# Altium schematic sheet power_schem.SchDoc
size B; SheetNumber: 2; SheetTotal: 3
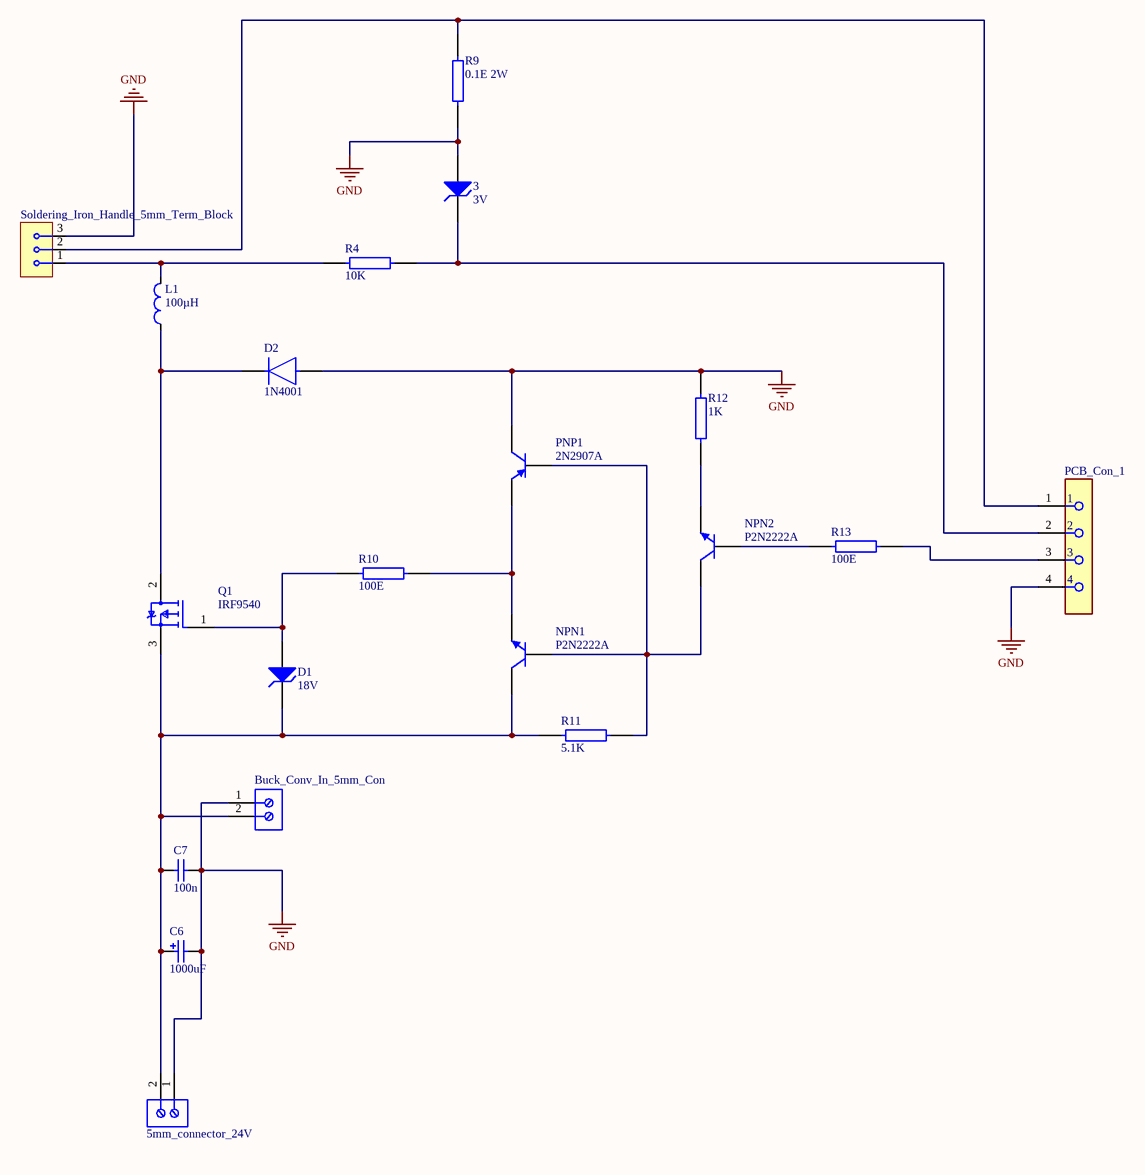
[diagram p0: power_schem.SchDoc]

## Parts
3  3V  [Zener_Diode]
5mm_connector_24V  (no value)  [screw_terminal]
Buck_Conv_In_5mm_Con  (no value)  [screw_terminal]
C6  1000uF  [Capacitor_Polarised]
C7  100n  [Capacitor_Monolitoc]
D1  18V  [Zener_Diode]
D2  1N4001  [Zener_Diode]
L1  100µH  [Coil]
NPN1  P2N2222A  [NPN_Transistor_2N2222A]
NPN2  P2N2222A  [NPN_Transistor_2N2222A]
PCB_Con_1  (no value)  [Header-Female-JST_4pin]
PNP1  2N2907A  [PNP_Transistor_2N2907A]
Q1  IRF9540  [Mosfet_IRF9540NPBF]
R4  10K  [Resistor]
R9  0.1E 2W  [Resistor]
R10  100E  [Resistor]
R11  5.1K  [Resistor]
R12  1K  [Resistor]
R13  100E  [Resistor]
Soldering_Iron_Handle_5mm_Term_Block  (no value)  [3Pin_Connector]

## Nets
GND: 3.2(A) 5mm_connector_24V.1 Buck_Conv_In_5mm_Con.1 C6.2 C7.2 D2.2(A) PCB_Con_1.4 PNP1.3(C) R9.1 R12.2 Soldering_Iron_Handle_5mm_Term_Block.3
Net3_1: 3.1(K) PCB_Con_1.2 R4.2
Net5mm_connector_24V_2: 5mm_connector_24V.2 Buck_Conv_In_5mm_Con.2 C6.1 C7.1 D1.1(K) NPN1.1(C) Q1.3(S) R11.1
NetD1_2: D1.2(A) Q1.1(G) R10.1
NetD2_1: D2.1(C) L1.1 Q1.2(D)
NetL1_2: L1.2 R4.1 Soldering_Iron_Handle_5mm_Term_Block.1
NetNPN1_2: NPN1.2(B) NPN2.1(C) PNP1.2(B) R11.2
NetNPN1_3: NPN1.3(E) PNP1.1(E) R10.2
NetNPN2_2: NPN2.2(B) R13.2
NetNPN2_3: NPN2.3(E) R12.1
NetPCB_Con_1_1: PCB_Con_1.1 R9.2 Soldering_Iron_Handle_5mm_Term_Block.2
NetPCB_Con_1_3: PCB_Con_1.3 R13.1

## Library data of the parts
3 D1 = Zener_Diode: PartNumber: 1N5931BRLG; Manufacturer: On Semiconductor; Packing: Tape and Reel; VZ Typ (V): 18; DatasheetVersion: Rev. 5; PackageVersion: Rev. U, 02/2005; ComponentLink1URL: http://www.onsemi.com/; ComponentLink3URL: http://www.onsemi.cn/pub_link/Collateral/59-10.PDF; RoHS: Pb-Free; ComponentLink3Description: Package Specification; ComponentLink1Description: Manufacturer URL; PackageReference: AXIAL_LEAD-2-59-10; PackageDescription: 2-Pin, Axial Lead, Diameter 2.35 mm; ComponentLink2URL: http://www.onsemi.cn/pub_link/Collateral/1N5913B-D.PDF; ComponentLink2Description: Datasheet; Mounting Technology: Through Hole
5mm_connector_24V Buck_Conv_In_5mm_Con = Screw_Terminal: NexarPartId: 18818288; Plating: Brass, Steel; Current: 10A; Pitch: 3.5052mm; Number of Levels: 1; Number of Contacts: 2; Wire Gauge (Min): 16AWG; Voltage: 300V; Wire Gauge (Max): 24AWG; Stripping Length: -6mm; Number of Pins: 2; Number of Rows: 1; REACH SVHC: Unknown; RoHS: Compliant; Housing Material: Nylon; Termination: Screw; Mount: Through Hole; Contact Plating: Brass, Tin; Number of Positions Per Level: 2; Color: Blue, Green; Width: 7.9mm; Voltage Rating: 300V; Length: 7.4mm; Current Rating: 10A; Wire/Cable Gauge: 24AWG; Packaging: Box; Max Operating Temperature: 105°C; Lead Pitch: 3.5mm; Height: 8.7mm; Contact Material: Brass; Min Operating Temperature: -40°C
C6 = Capacitor_Polarised: Manufacturer: Murata; Packaging type: Bulk; CS: 5mm; Tolerance: 10%; Capacity (elec.): 10nF; Material: Ceramic; Type: radiallead; Industrial packaging: Yes; Nominal voltage: 1000V; Content: 500pc(s); Category: Ceramiccapacitor; Datasheet Version: 06/2016; Package Reference: DEBF33A103ZA2B; Mounting Technology: ThroughHole; Package Description: 2-Pin Through Hole Device, Body 4 x 10 mm, Pitch 5 mm; Datasheet URL: http://psearch.en.murata.com/capacitor/product/DEBF33A103ZA2B.pdf; Manufacturer URL: http://www.murata.com/
C7 = Capacitor_Monolitic: Manufacturer: Murata; Packaging type: Bulk; CS: 5mm; Tolerance: 10%; Capacity (elec.): 10nF; Material: Ceramic; Type: radiallead; Industrial packaging: Yes; Nominal voltage: 1000V; Content: 500pc(s); Category: Ceramiccapacitor; Datasheet Version: 06/2016; Package Reference: DEBF33A103ZA2B; Mounting Technology: ThroughHole; Package Description: 2-Pin Through Hole Device, Body 4 x 10 mm, Pitch 5 mm; Datasheet URL: http://psearch.en.murata.com/capacitor/product/DEBF33A103ZA2B.pdf; Manufacturer URL: http://www.murata.com/
D2 = Diode_UF5408: Capacitance: 36pF; Average Rectified Current: 3A; Recovery Time: 75ns; Max Reverse Current: 10uA; Outside Diameter: 5.3mm; Forward Voltage: 1.7V; Peak Non-Repetitive Surge Current: 150A; Max Repetitive Reverse Voltage (Vrrm): 1kV; Element Configuration: Single; Polarity: Standard; Width: 5.3mm; Mount: Through Hole; Number of Pins: 2; Case/Package: DO-201AD; Series: -; Packaging: Tape and Reel; Max Surge Current: 150A; Length: 9.5mm; Lead Free: Lead Free; Termination: Axial; Reverse Recovery Time-Max: 75ns; Max Operating Temperature: 150°C; Height: 5.3mm; Forward Current: 3A; Radiation Hardening: No; RoHS Compliant: Yes; Min Operating Temperature: -55°C; Output Current: 3A; Reverse Voltage: 1kV; Reverse Recovery Time: 75ns; Max Forward Surge Current (Ifsm): 150A; Package Quantity: 1; Max Reverse Voltage (DC): 1kV
L1 = 100µH_Inductor: Inductance: 100uH; Sample Rate (Hz): 100kHz; Inductance Tolerance: 20%; DC Resistance (DCR): 494mR; Shielding: Shielded; Current Rating: 700mA; Saturation Current: 800mA; Material: Steel; Core Material: Ferrite; Self Resonant Frequency: 5MHz; Termination: SMD/SMT; Packaging: Tape and Reel; Resistor Type: Wirewound; Height: 4.5mm; Number of Pins: 2; Radiation Hardening: No; Height - Seated (Max): 0.177inch; Military Standard: Not; Max DC Current: 700mA; Depth: 6.2mm; Length: 6mm; Weight: 0.027725oz; RoHS Compliant: Yes; Mount: Surface Mount; REACH SVHC: No SVHC; Test Frequency: 100kHz; Tolerance: 20%; Package Quantity: 1000; Width: 6mm; Series: SRN6045; DC Current: 700mA; RMS Current (Irms): 700mA; Case/Package: Nonstandard; Min Operating Temperature: -40°C; Max Operating Temperature: 125°C
NPN1 NPN2 = NPN_Transistor_2N2222A: PartNumber: P2N2222AG; Manufacturer: On Semiconductor; IC Continuous (A): 0.6; Polarity: NPN; Packing: Bulk Box; fT Min (MHz): 300; ComponentLink2Description: Datasheet; ComponentLink1Description: Manufacturer URL; ComponentLink2URL: http://www.onsemi.com/pub_link/Collateral/P2N2222A-D.PDF; ComponentLink3Description: Package Specification; RoHS: TRUE; ComponentLink1URL: http://www.onsemi.com/; Mounting Technology: Through Hole; PackageReference: TO-92-3-29-11_AM_SL; DatasheetVersion: Rev. 7; PackageDescription: 3-Pin Transistor Outline, Body 4.825 x 3.685 mm, Pitch 1.27 mm; PackageVersion: Rev. AM; ComponentLink3URL: http://www.onsemi.cn/pub_link/Collateral/2N6426-D.PDF
PCB_Con_1 = Header-Female-JST_4pin: Contact Resistance: 10mR; Number of Positions: 4; Pitch: 2.54mm; Gender: Female; Connector Type: Receptacle; Max Current Rating: 1A; Color: Black; Contact Material: Copper; Min Operating Temperature: -55°C; Max Operating Temperature: 125°C; Radiation Hardening: No; Termination: Solder; Depth: 2.54mm; Contact Plating: Gold; Orientation: Straight; Housing Color: Black; Width: 2.54mm; RoHS Compliant: Yes; Lead Free: Lead Free; Mount: Through Hole; Series: SS; Length: 10.16mm; Packaging: Bulk; Package Quantity: 1; Housing Material: Polyester; Number of Contacts: 4; Number of Rows: 1
PNP1 = PNP_Transistor_2N2907A: Manufacturer: On Semiconductor; PartNumber: MPSA92G; IC Continuous (A): -0.5; Polarity: PNP; fT Min (MHz): 50; Packing: Bulk Box; DatasheetVersion: Rev. 6; ComponentLink2Description: Datasheet; PackageReference: TO-92-3-29-11_AM_SL; RoHS: TRUE; ComponentLink3Description: Package Specification; PackageDescription: 3-Pin Transistor Outline, Body 4.825 x 3.685 mm, Pitch 1.27 mm; ComponentLink3URL: http://www.onsemi.cn/pub_link/Collateral/2N6426-D.PDF; ComponentLink1Description: Manufacturer URL; ComponentLink1URL: http://www.onsemi.com/; Mounting Technology: Through Hole; ComponentLink2URL: http://www.onsemi.cn/pub_link/Collateral/MPSA92-D.PDF; PackageVersion: Rev. AM
Q1 = Mosfet_IRF9540NPBF: Number of Channels: 1; Max Dual Supply Voltage: -100V; Rise Time: 67ns; Max Power Dissipation: 3.1W; Gate to Source Voltage (Vgs): 20V; Drain to Source Resistance: 117mR; Turn-On Delay Time: 13ns; Turn-Off Delay Time: 40ns; Threshold Voltage: 4V; Input Capacitance: 1.45nF; Continuous Drain Current (ID): 23A; Power Dissipation: 110W; Length: 0.42inch; Max Operating Temperature: 150°C; Case/Package: TO-262; Packaging: Rail/Tube; Height: 0.38inch; Drain to Source Voltage (Vdss): -100V; Lead Free: Contains Lead; Rds On Max: 117mR; Width: 0.19inch; Min Operating Temperature: -55°C; RoHS Compliant: Yes; Mount: Through Hole; Number of Pins: 3; Halogen Free: Not Halogen Free; REACH SVHC: No SVHC
R4 R9-R13 = Resistor: NexarPartId: 44386654; Tolerance: 1%; Max Power Dissipation: 250mW; Voltage Rating: 200V; Power Rating: 125mW; Temperature Coefficient: 50ppm/°C; Resistance: 73.2kΩ; Width: 1.65mm; Length: 3.81mm; Schedule B: 8533210090, 8533210090|8533210090|8533210090|8533210090|8533210090; Termination: Axial; Lead Free: Lead Free; Diameter: 1.65mm; Voltage Rating (DC): 200V; Packaging: Cut Tape; Max Operating Temperature: 175°C; Composition: Metal Film; RoHS: Compliant; Mount: Through Hole; Features: Flame Retardant Coating, Moisture Resistant; Number of Terminations: 2; Min Operating Temperature: -55°C; Case/Package: Axial
Soldering_Iron_Handle_5mm_Term_Block = 3Pin_Connector